# EAGLE design R451E (EAGLE 6.6.0)
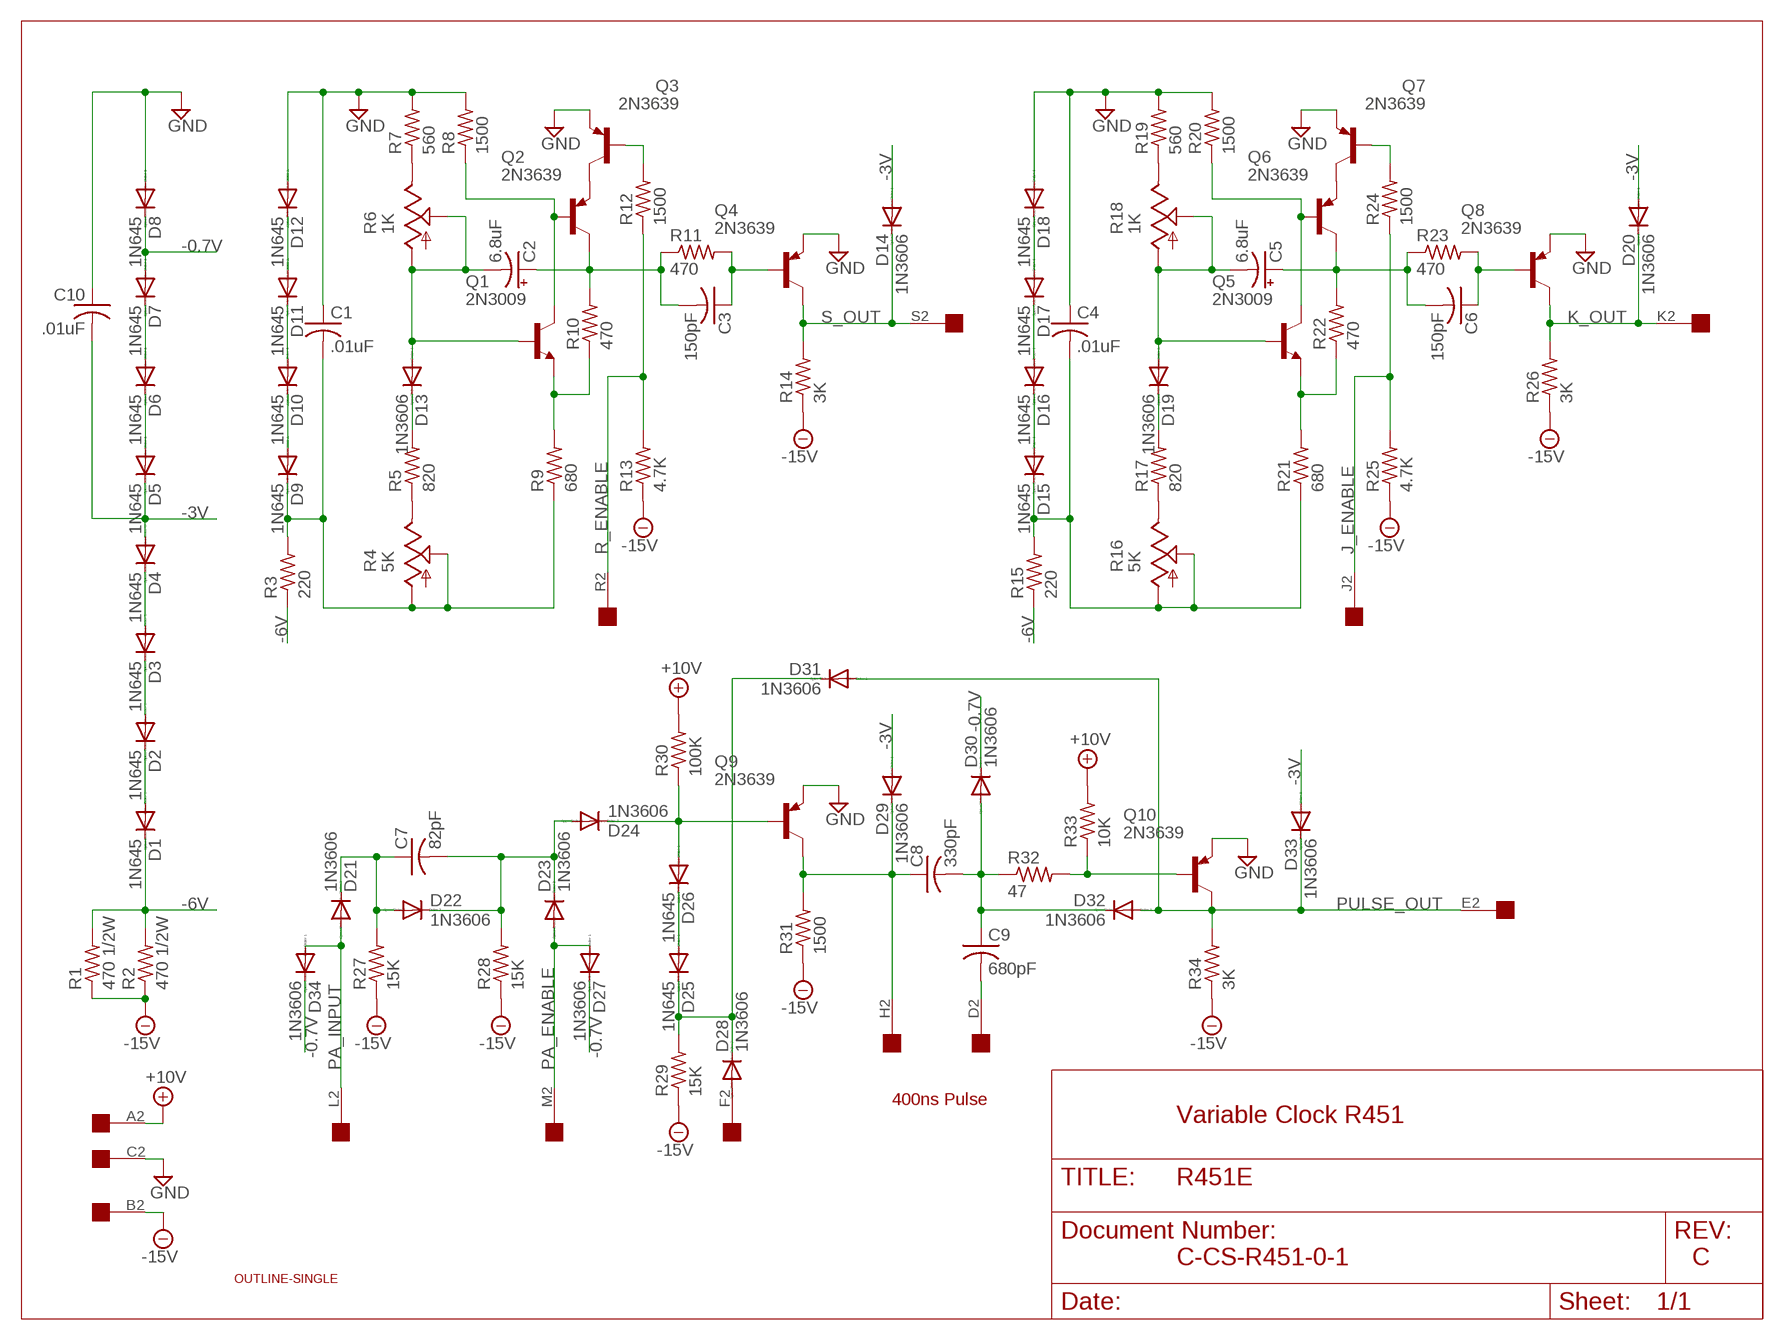
[diagram p0: schematic, sheet 1]

## Parts
C1  .01uF  C-US050-025X075  [C050-025X075]
C2  6.8uF  CPOL-USE12-4AXIAL  [E12-4]
C3  150pF  C-US075-032X103  [C075-032X103]
C4  .01uF  C-US050-025X075  [C050-025X075]
C5  6.8uF  CPOL-USE12-4AXIAL  [E12-4]
C6  150pF  C-US075-032X103  [C075-032X103]
C7  82pF  C-US075-032X103  [C075-032X103]
C8  330pF  C-US075-032X103  [C075-032X103]
C9  680pF  C-US075-032X103  [C075-032X103]
C10  .01uF  C-US050-025X075  [C050-025X075]
D1  1N645  1N4148DO35-10  [DO35-10]
D2  1N645  1N4148DO35-10  [DO35-10]
D3  1N645  1N4148DO35-10  [DO35-10]
D4  1N645  1N4148DO35-10  [DO35-10]
D5  1N645  1N4148DO35-10  [DO35-10]
D6  1N645  1N4148DO35-10  [DO35-10]
D7  1N645  1N4148DO35-10  [DO35-10]
D8  1N645  1N4148DO35-10  [DO35-10]
D9  1N645  1N4148DO35-10  [DO35-10]
D10  1N645  1N4148DO35-10  [DO35-10]
D11  1N645  1N4148DO35-10  [DO35-10]
D12  1N645  1N4148DO35-10  [DO35-10]
D13  1N3606  1N4148DO35-10  [DO35-10]
D14  1N3606  1N4148DO35-10  [DO35-10]
D15  1N645  1N4148DO35-10  [DO35-10]
D16  1N645  1N4148DO35-10  [DO35-10]
D17  1N645  1N4148DO35-10  [DO35-10]
D18  1N645  1N4148DO35-10  [DO35-10]
D19  1N3606  1N4148DO35-10  [DO35-10]
D20  1N3606  1N4148DO35-10  [DO35-10]
D21  1N3606  1N4148DO35-10  [DO35-10]
D22  1N3606  1N4148DO35-10  [DO35-10]
D23  1N3606  1N4148DO35-10  [DO35-10]
D24  1N3606  1N4148DO35-10  [DO35-10]
D25  1N645  1N4148DO35-10  [DO35-10]
D26  1N645  1N4148DO35-10  [DO35-10]
D27  1N3606  1N4148DO35-10  [DO35-10]
D28  1N3606  1N4148DO35-10  [DO35-10]
D29  1N3606  1N4148DO35-10  [DO35-10]
D30  1N3606  1N4148DO35-10  [DO35-10]
D31  1N3606  1N4148DO35-10  [DO35-10]
D32  1N3606  1N4148DO35-10  [DO35-10]
D33  1N3606  1N4148DO35-10  [DO35-10]
D34  1N3606  1N4148DO35-10  [DO35-10]
Q1  2N3009  2N2102  [TO5]
Q2  2N3639  2N2904  [TO39]
Q3  2N3639  2N2904  [TO39]
Q4  2N3639  2N2904  [TO39]
Q5  2N3009  2N2102  [TO5]
Q6  2N3639  2N2904  [TO39]
Q7  2N3639  2N2904  [TO39]
Q8  2N3639  2N2904  [TO39]
Q9  2N3639  2N2904  [TO39]
Q10  2N3639  2N2904  [TO39]
R1  470 1/2W  R-US_0411/15  [0411/15]
R2  470 1/2W  R-US_0411/15  [0411/15]
R3  220  R-US_0207/10  [0207/10]
R4  5K  TRIM_US-CT6  [CT6]
R5  820  R-US_0207/10  [0207/10]
R6  1K  TRIM_US-CT6  [CT6]
R7  560  R-US_0207/10  [0207/10]
R8  1500  R-US_0207/10  [0207/10]
R9  680  R-US_0207/10  [0207/10]
R10  470  R-US_0207/10  [0207/10]
R11  470  R-US_0207/10  [0207/10]
R12  1500  R-US_0207/10  [0207/10]
R13  4.7K  R-US_0207/10  [0207/10]
R14  3K  R-US_0207/10  [0207/10]
R15  220  R-US_0207/10  [0207/10]
R16  5K  TRIM_US-CT6  [CT6]
R17  820  R-US_0207/10  [0207/10]
R18  1K  TRIM_US-CT6  [CT6]
R19  560  R-US_0207/10  [0207/10]
R20  1500  R-US_0207/10  [0207/10]
R21  680  R-US_0207/10  [0207/10]
R22  470  R-US_0207/10  [0207/10]
R23  470  R-US_0207/10  [0207/10]
R24  1500  R-US_0207/10  [0207/10]
R25  4.7K  R-US_0207/10  [0207/10]
R26  3K  R-US_0207/10  [0207/10]
R27  15K  R-US_0207/10  [0207/10]
R28  15K  R-US_0207/10  [0207/10]
R29  15K  R-US_0207/10  [0207/10]
R30  100K  R-US_0207/10  [0207/10]
R31  1500  R-US_0207/10  [0207/10]
R32  47  R-US_0207/10  [0207/10]
R33  10K  R-US_0207/10  [0207/10]
R34  3K  R-US_0207/10  [0207/10]
U$1  OUTLINE-SINGLE  [SINGLE]
U$2  EDGE-1  [EDGE-CON1]

## Nets
+10V [Supply]: R30.2 R33.2 U$2.A2
-0.7V [Supply]: D7.A D8.C D27.C D30.C D34.C
-3V [Supply]: C10.2 D4.A D5.C D14.A D20.A D29.A D33.A
-6V [Supply]: D1.C R1.2 R2.2 R3.1 R15.1
-15V [Supply]: R1.1 R2.1 R13.1 R14.1 R25.1 R26.1 R27.1 R28.1 R29.1 R31.1 R34.1 U$2.B2
GND [Supply]: C1.1 C4.1 C10.1 D8.A D12.A D18.A Q3.1(E) Q4.1(E) Q7.1(E) Q8.1(E) Q9.1(E) Q10.1(E) R7.2 R8.2 R19.2 R20.2 U$2.C2
J_ENABLE: R24.1 R25.2 U$2.J2
K_OUT: D20.C Q8.3(C) R26.2 U$2.K2
N$1 [Supply]: D1.A D2.C
N$2 [Supply]: D5.A D6.C
N$3: D11.A D12.C
N$4: D10.A D11.C
N$5: D9.A D10.C
N$6 [Supply]: C1.2 D9.C R3.2 R4.A R4.S R9.1
N$7: Q1.1(E) R9.2 R10.1
N$8: R4.E R5.1
N$9: D13.C R5.2
N$10: C2.- D13.A Q1.2(B) R6.A R6.S
N$11: Q1.3(C) Q2.2(B) R8.1
N$12: C2.+ C3.2 Q2.3(C) R10.2 R11.1
N$13 [Supply]: D2.A D3.C
N$14 [Supply]: D3.A D4.C
N$15: Q3.2(B) R12.2
N$16: Q2.1(E) Q3.3(C)
N$17: R6.E R7.1
N$18: C3.1 Q4.2(B) R11.2
N$19: D17.A D18.C
N$20: D16.A D17.C
N$21: D15.A D16.C
N$22: C4.2 D15.C R15.2 R16.A R16.S R21.1
N$23: D19.C R17.2
N$24: D28.A U$2.F2
N$25: Q5.1(E) R21.2 R22.1
N$26: C7.1 D21.C D22.A R27.2
N$27: C5.- D19.A Q5.2(B) R18.A R18.S
N$28: C7.2 D22.C D23.C D24.A R28.2
N$29: Q5.3(C) Q6.2(B) R20.1
N$30: Q6.1(E) Q7.3(C)
N$32: R18.E R19.1
N$33: R16.E R17.1
N$34: C5.+ C6.2 Q6.3(C) R22.2 R23.1
N$35: C6.1 Q8.2(B) R23.2
N$36: Q7.2(B) R24.2
N$37: C8.1 D29.C Q9.3(C) R31.2 U$2.H2
N$39: D24.C D26.A Q9.2(B) R30.1
N$40: D25.A D26.C
N$41: D25.C D28.C D31.C R29.2
N$43: C8.2 C9.1 D30.A D32.C R32.1
N$44: C9.2 U$2.D2
N$45: Q10.2(B) R32.2 R33.1
N$47 [Supply]: D6.A D7.C
PA_ENABLE: D23.A D27.A U$2.M2
PA_INPUT: D21.A D34.A U$2.L2
PULSE_OUT: D31.A D32.A D33.C Q10.3(C) R34.2 U$2.E2
R_ENABLE: R12.1 R13.2 U$2.R2
S_OUT: D14.C Q4.3(C) R14.2 U$2.S2
Unconnected: U$2.N2 U$2.P2 U$2.T2 U$2.U2 U$2.V2

## Notes on the sheet
- 400ns Pulse
- Variable Clock R451
- C-CS-R451-0-1 | C

## Library data of the parts
C1 C3 C4 C6-C10 = rcl:C-US: CAPACITOR, American symbol
C2 C5 = dec-con:CPOL-USE12-4AXIAL: 0.5" veresion of an electrolytic
D1-D34 = diode:1N4148: DIODE high speed (Philips)
Q1 Q5 = transistor-npn:2N2102: NPN Transistor
Q2-Q4 Q6-Q10 = transistor-pnp:2N2904*: PNP Transistror
R1-R3 R5 R7-R15 R17 R19-R34 = rcl:R-US_: RESISTOR, American symbol
R4 R6 R16 R18 = pot:TRIM_US-: POTENTIOMETER
U$1 = dec-con:OUTLINE-*: Board outlines for DEC boards.
U$2 = dec-con:EDGE-1: Single-Sided DEC Edge Connector -- (side 2)

## Net classes
1 Supply: width 0.813 mm

## Board
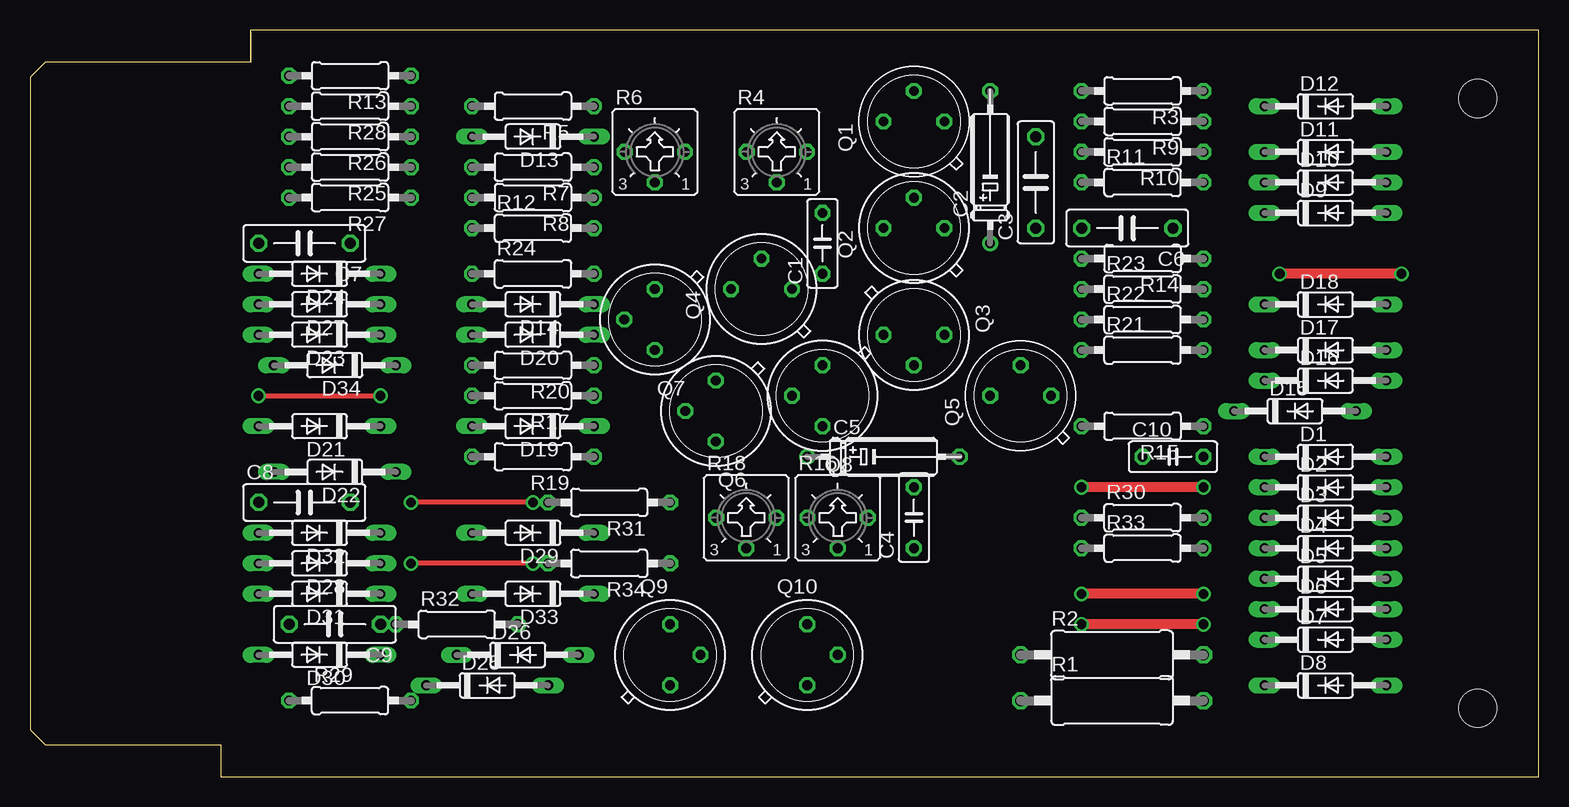
[diagram p1: board, top side]
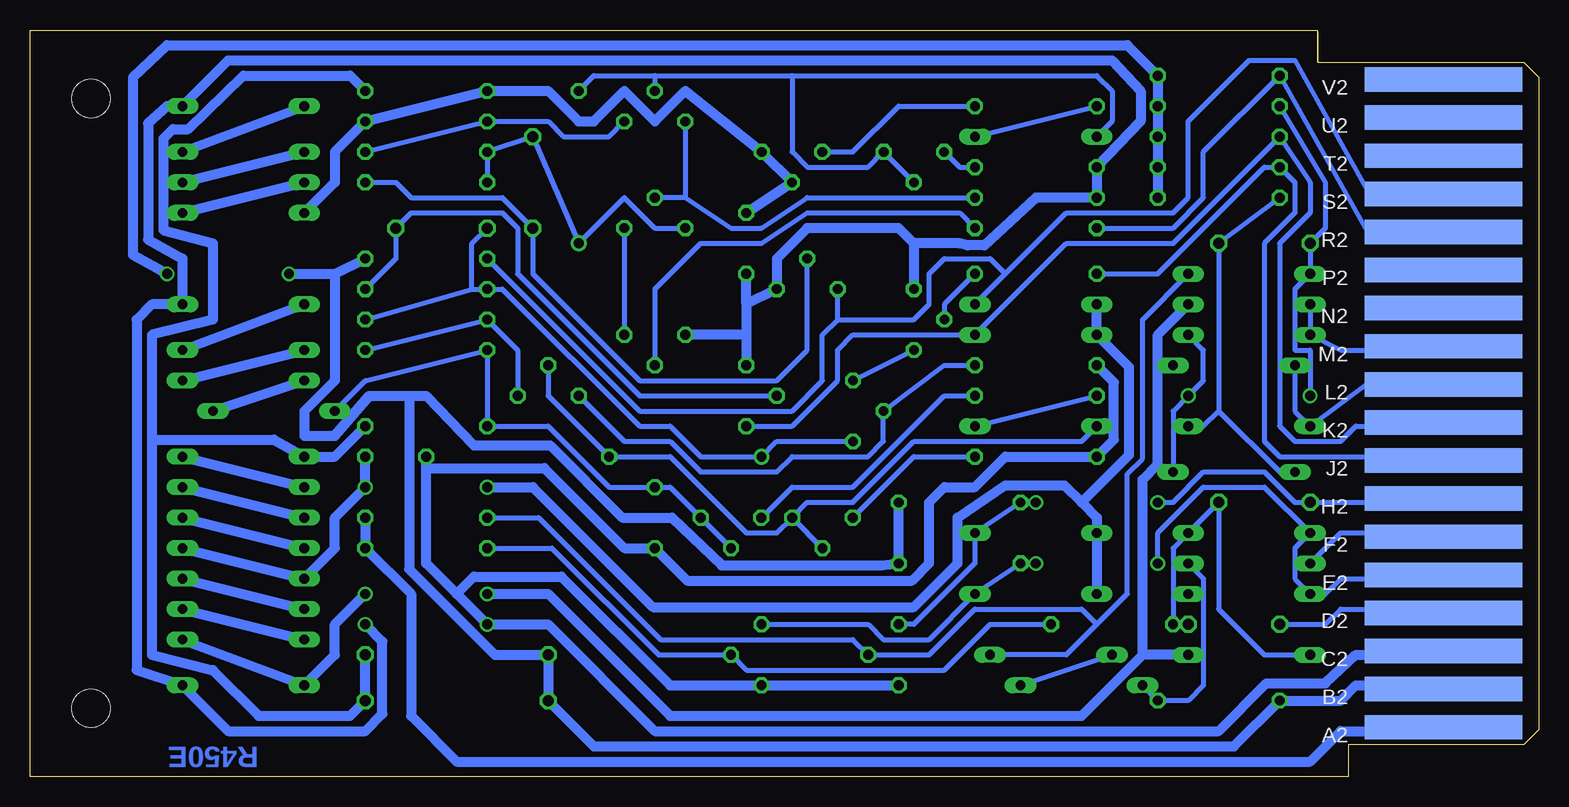
[diagram p2: board, bottom side, seen from below]

Size 125.73 x 62.23 mm. Coordinates in mm from the lower left corner, seen from the top.
Copper layers (1+16): Top 0.035mm / dielectric 1.5mm / Bottom 0.035mm
Design rules "16mils": minimum track width 16mil, minimum drill 32mil, track to track 15mil, track to pad 10mil, pad to pad 10mil, via to via 10mil, smd to smd 10mil, copper to edge 13mil, drill to drill 10mil, minimum pad ring 10mil, minimum via ring 8mil, stop-mask expansion 0mil, vias tented up to drill 0mil, thermal gap 10mil

### Footprints (pad centres in the part's own frame; a part is rotated, then mirrored left to right if it is on the bottom)
C050-025X075 = drill 0.813 octagon: 1 -2.54,0; 2 2.54,0
E12-4 = drill 0.813: + -7.62,0 | drill 0.813 octagon: - 5.08,0
C075-032X103 = drill 0.914 octagon: 1 -3.81,0; 2 3.81,0
DO35-10 = drill 0.813 long: A 5.08,0; C -5.08,0
TO5 = drill 0.813 octagon: 1 0,-2.54; 2 2.54,0; 3 0,2.54
TO39 = drill 0.813 octagon: 1 0,-2.54; 2 2.54,0; 3 0,2.54
0411/15 = drill 0.914 octagon: 1 -7.62,0; 2 7.62,0
0207/10 = drill 0.813 octagon: 1 -5.08,0; 2 5.08,0
CT6 = drill 0.813 octagon: A 2.515,0; E -2.515,0; S 0,-2.54
SINGLE = hole 3.175: 120.65,56.515; 120.65,5.715
EDGE-CON1 = smd 13.106 x 2.032 bottom: A2 7.938,4.128; B2 7.938,7.303; C2 7.938,10.477; D2 7.938,13.652; E2 7.938,16.828; F2 7.938,20.003; H2 7.938,23.177; J2 7.938,26.352; K2 7.938,29.527; L2 7.938,32.703; M2 7.938,35.877; N2 7.938,39.053; P2 7.938,42.227; R2 7.938,45.403; S2 7.938,48.578; T2 7.938,51.752; U2 7.938,54.928; V2 7.938,58.102

### Placement (x,y rotation side)
C1  66.04,44.45 90 top
C2  80.01,52.07 90 top
C3  83.82,49.53 90 top
C4  73.66,21.59 90 top
C5  72.39,26.67 0 top
C6  91.44,45.72 180 top
C7  22.86,44.45 180 top
C8  22.86,22.86 0 top
C9  25.4,12.7 180 top
C10  95.25,26.67 0 top
D1  107.95,26.67 0 top
D2  107.95,24.13 0 top
D3  107.95,21.59 0 top
D4  107.95,19.05 0 top
D5  107.95,16.51 0 top
D6  107.95,13.97 0 top
D7  107.95,11.43 0 top
D8  107.95,7.62 0 top
D9  107.95,46.99 0 top
D10  107.95,49.53 0 top
D11  107.95,52.07 0 top
D12  107.95,55.88 0 top
D13  41.91,53.34 180 top
D14  41.91,39.37 180 top
D15  105.41,30.48 0 top
D16  107.95,33.02 0 top
D17  107.95,35.56 0 top
D18  107.95,39.37 0 top
D19  41.91,29.21 180 top
D20  41.91,36.83 180 top
D21  24.13,29.21 180 top
D22  25.4,25.4 180 top
D23  24.13,36.83 180 top
D24  24.13,41.91 180 top
D25  38.1,7.62 0 top
D26  40.64,10.16 0 top
D27  24.13,39.37 180 top
D28  24.13,17.78 180 top
D29  41.91,20.32 180 top
D30  24.13,10.16 180 top
D31  24.13,15.24 180 top
D32  24.13,20.32 180 top
D33  41.91,15.24 180 top
D34  25.4,34.29 180 top
Q1  73.66,54.61 90 top
Q2  73.66,45.72 90 top
Q3  73.66,36.83 270 top
Q4  60.96,40.64 90 top
Q5  82.55,31.75 90 top
Q6  57.15,30.48 180 top
Q7  52.07,38.1 180 top
Q8  66.04,31.75 180 top
Q9  53.34,10.16 0 top
Q10  64.77,10.16 0 top
R1  90.17,6.35 0 top
R2  90.17,10.16 0 top
R3  92.71,57.15 180 top
R4  62.23,52.07 0 top
R5  41.91,55.88 180 top
R6  52.07,52.07 0 top
R7  41.91,50.8 180 top
R8  41.91,48.26 180 top
R9  92.71,54.61 180 top
R10  92.71,52.07 180 top
R11  92.71,49.53 0 top
R12  41.91,45.72 0 top
R13  26.67,58.42 180 top
R14  92.71,43.18 180 top
R15  92.71,29.21 180 top
R16  67.31,21.59 0 top
R17  41.91,31.75 180 top
R18  59.69,21.59 0 top
R19  41.91,26.67 180 top
R20  41.91,34.29 180 top
R21  92.71,35.56 0 top
R22  92.71,38.1 0 top
R23  92.71,40.64 0 top
R24  41.91,41.91 0 top
R25  26.67,50.8 180 top
R26  26.67,53.34 180 top
R27  26.67,48.26 180 top
R28  26.67,55.88 180 top
R29  26.67,6.35 0 top
R30  92.71,21.59 0 top
R31  48.26,22.86 180 top
R32  35.56,12.7 0 top
R33  92.71,19.05 0 top
R34  48.26,17.78 180 top
U$1  0,0 0 top
U$2  0,0 0 top

### Tracks (layer width: path | path; a pad name or v marks a point on that pad's centre or on a via)
+10V
  Bottom 0.813: U$2.A2 8.51,4.19 8.89,3.81 16.51,3.81 19.05,1.27 90.17,1.27 93.98,5.08 93.98,15.24 R33.2 R30.2
-0.7V  (via drill 0.81)
  Top 0.813: v97.79,15.24 v87.63,15.24
  Bottom 0.813: D7.A D8.C 100.33,10.16 100.33,12.7 v97.79,15.24 | v87.63,15.24 82.55,15.24 72.39,5.08 38.1,5.08 33.02,10.16 | D27.C 31.75,36.83 31.75,34.29 | 33.02,10.16 33.02,24.77 31.75,26.04 31.75,34.29 | D30.C 33.02,10.16 | D34.C 31.75,34.29
-3V  (via drill 0.81)
  Top 0.813: v97.79,24.13 v87.63,24.13
  Bottom 0.813: D4.A D5.C 100.33,19.05 100.33,21.59 v97.79,24.13 C10.2 | D14.A D20.A 34.13,34.13 34.13,26.83 38.1,22.86 | v87.63,24.13 83.82,24.13 73.82,14.13 52.07,14.13 48.42,17.78 48.42,21.59 | 48.42,21.59 | 48.42,21.59 44.45,24.29 39.53,24.29 38.1,22.86 | 38.1,22.86 36.83,21.59 D29.A D33.A
-6V
  Bottom 0.813: R2.2 R1.2 99.06,5.08 106.68,5.08 110.49,8.89 115.57,10.16 115.57,28.1 | 115.57,28.1 105.41,28.1 D1.C 100.33,26.67 R15.1 | R3.1 99.06,58.42 107.95,58.42 112.55,53.98 113.82,53.98 114.62,53.18 114.62,45.56 110.49,44.45 110.49,38.1 115.57,36.83 115.57,28.1
-15V  (via drill 0.81)
  Top 0.813: v114.3,41.91 v104.14,41.91
  Bottom 0.813: U$2.B2 8.6,7.33 8.89,7.62 15.24,7.62 16.51,6.35 R29.1 25.4,2.54 78.74,2.54 R1.1 R2.1 86.99,10.16 94.14,17.3 94.14,31.75 | R27.1 R25.1 R26.1 R28.1 R13.1 34.29,60.96 114.3,60.96 117.16,58.26 117.16,43.5 v114.3,41.91 | v104.14,41.91 100.33,41.91 | 100.33,41.91 R14.1 | R31.1 R34.1 54.77,17.62 68.1,17.62 72.23,21.59 76.36,21.59 82.39,27.62 86.36,27.62 88.74,27.62 92.71,31.75 94.14,31.75 | 100.33,41.91 100.33,33.02 102.87,30.48 102.87,28.42 100.33,28.42 97.47,31.75 94.14,31.75
GND  (via drill 0.81)
  Top 0.813: v97.79,12.7 v87.63,12.7
  Bottom 0.813: v97.79,12.7 96.36,11.27 96.36,5.24 97.79,3.81 109.22,3.81 D8.A 116.84,8.89 116.84,38.1 115.57,39.37 D18.A 113.03,43.18 115.89,44.77 115.89,54.45 114.3,55.88 D12.A 109.22,59.69 35.56,59.69 33.18,57.15 33.18,54.61 R7.2 R8.2 41.91,48.26 46.2,44.29 47.62,44.29 48.26,44.45 52.07,44.45 | 90.17,15.24 92.71,17.78 92.71,25.72 | 90.17,15.24 v87.63,12.7 82.55,12.7 73.66,3.81 26.67,3.81 22.7,7.78 17.78,7.78 15.24,10.16 8.89,10.16 U$2.C2 | 66.04,36.83 Q3.1 | 66.04,39.37 Q4.1 63.5,43.18 60.96,45.72 53.34,45.72 52.07,44.45 | 52.07,44.45 Q7.1 | 66.04,39.37 C1.1 | 66.04,39.37 66.04,36.83 | 66.04,36.83 Q8.1 | Q9.1 Q10.1 72.39,7.62 81.44,16.67 88.74,16.67 90.17,15.24 | 92.71,25.72 C10.1 | 92.71,25.72 82.87,25.72 76.2,19.05 C4.1 70.96,16.35 52.23,16.35 50.8,17.78 50.8,22.86 49.53,24.13 46.99,24.13 44.45,26.67 R19.2 35.4,28.1 35.4,32.86 R20.2
J_ENABLE
  Bottom 0.406: U$2.J2 8.56,26.34 8.89,26.67 21.59,26.67 22.86,27.94 22.86,44.45 20.32,46.99 20.32,49.53 R25.2 22.86,50.8 31.75,41.91 R24.1
K_OUT
  Bottom 0.406: U$2.K2 8.59,29.52 8.89,29.21 15.24,29.21 16.51,27.94 20.32,27.94 21.59,29.21 21.59,44.45 19.05,46.99 19.05,49.53 R26.2 30.48,44.45 39.37,44.45 D20.C 57.15,36.83 58.42,35.56 58.42,33.02 62.23,29.21 Q8.3
N$1
  Bottom 0.813: D1.A D2.C
N$2
  Bottom 0.813: D5.A D6.C
N$3
  Bottom 0.813: D11.A D12.C
N$4
  Bottom 0.813: D10.A D11.C
N$5
  Bottom 0.813: D9.A D10.C
N$6
  Bottom 0.813: D9.C 100.33,49.53 100.33,52.07 R9.1 R3.2 82.55,57.15 80.01,54.61 78.74,54.61 76.2,57.15 73.66,54.61 71.12,57.15 64.77,52.07 R4.A 64.74,52.04 R4.S C1.2
N$7
  Bottom 0.406: R10.1 R9.2 82.55,54.61 81.28,53.34 77.47,53.34 Q1.1
N$8
  Bottom 0.406: R4.E 57.15,52.07 53.34,55.88 R5.1
N$9
  Bottom 0.406: D13.C R5.2
N$10
  Bottom 0.406: D13.A 35.56,54.61 35.56,57.15 36.83,58.42 62.23,58.42 | 54.61,52.07 55.88,50.8 60.96,50.8 62.23,52.07 62.23,58.42 | C2.- 78.74,58.42 73.66,58.42 | 73.66,58.42 Q1.2 | 73.66,58.42 62.23,58.42 | 54.61,52.07 R6.A | 54.61,52.07 R6.S
N$11
  Bottom 0.406: R8.1 60.96,48.26 64.77,45.72 67.31,45.72 71.12,48.26 | Q1.3 71.12,48.26 | 71.12,48.26 Q2.2
N$12
  Bottom 0.406: Q2.3 73.66,45.72 76.2,48.26 C2.+ C3.2 R10.2 R11.1
N$13
  Bottom 0.813: D2.A D3.C
N$14
  Bottom 0.813: D3.A D4.C
N$15
  Bottom 0.406: R12.2 48.26,46.99 60.96,46.99 64.77,44.45 69.85,44.45 73.66,40.64 Q3.2
N$16
  Bottom 0.406: Q2.1 Q3.3
N$17
  Bottom 0.406: R6.E 49.53,52.07 48.26,50.8 R7.1
N$18
  Bottom 0.406: R11.2 95.25,49.53 93.98,48.26 86.36,48.26 C3.1 83.82,41.91 74.93,33.02 63.5,33.02 60.96,35.56 Q4.2
N$19
  Bottom 0.813: D17.A D18.C
N$20
  Bottom 0.813: D16.A D17.C
N$21
  Bottom 0.813: D15.A D16.C
N$22
  Bottom 0.406: D15.C 97.79,33.02 R21.1 R15.2 82.55,29.21 77.47,24.13 C4.2 72.39,24.13 69.85,21.59 | 69.85,21.59 R16.A | 69.85,21.59 R16.S
N$23
  Bottom 0.406: D19.C R17.2
N$24
  Bottom 0.406: U$2.F2 7.92,20.32 16.51,20.32 D28.A
N$25
  Bottom 0.406: R21.2 R22.1 85.09,35.56 Q5.1
N$26
  Bottom 0.406: 26.67,30.48 27.94,29.21 D21.C | 26.67,30.48 C7.1 R27.2 | D22.A 21.59,25.4 26.67,30.48
N$27
  Bottom 0.406: Q5.2 82.55,31.75 C5.- 72.39,26.67 66.04,20.32 63.5,20.32 62.23,21.59 | 62.23,21.59 R18.S | D19.A 38.1,27.94 52.07,27.94 57.15,22.86 60.96,22.86 62.23,21.59 | 62.23,21.59 R18.A
N$28  (via drill 0.81)
  Top 0.406: v19.05,31.75 v29.21,31.75
  Bottom 0.406: D23.C 27.94,35.56 27.94,33.02 v29.21,31.75 30.48,30.48 D22.C | v19.05,31.75 19.05,35.56 20.32,35.56 20.32,40.64 D24.A C7.2 17.78,45.72 17.78,49.53 R28.2
N$29
  Bottom 0.406: Q5.3 76.2,27.94 72.39,27.94 69.85,25.4 63.5,25.4 62.23,26.67 55.88,26.67 54.61,27.94 Q6.2 49.53,34.29 R20.1
N$30
  Bottom 0.406: Q6.1 Q7.3
N$32
  Bottom 0.406: R18.E 57.15,21.59 52.07,26.67 R19.1
N$33
  Bottom 0.406: R16.E 64.77,21.59 62.23,24.13 57.15,24.13 49.53,31.75 R17.1
N$34
  Bottom 0.406: Q6.3 63.5,27.94 C5.+ 69.85,26.67 72.39,29.21 74.93,29.21 86.36,40.64 R23.1 88.9,40.64 | C6.2 88.9,44.45 88.9,40.64 | R22.2 88.9,40.64
N$35
  Bottom 0.406: R23.2 95.25,43.18 C6.1 93.98,46.99 86.36,46.99 85.09,45.72 85.09,41.91 74.93,31.75 Q8.2
N$36
  Bottom 0.406: Q7.2 49.53,39.37 R24.2
N$37  (via drill 0.81)
  Top 0.406: v41.91,22.86 v31.75,22.86
  Bottom 0.406: U$2.H2 7.97,22.86 C8.1 20.32,22.86 22.86,25.4 27.94,25.4 30.48,22.86 v31.75,22.86 | Q9.3 52.07,12.7 46.99,17.78 D29.C R31.2 v41.91,22.86
N$39
  Bottom 0.406: D24.C 33.02,38.1 33.02,26.51 34.29,25.24 34.29,15.24 36.83,12.7 | 36.83,12.7 39.37,10.16 D26.A | R30.1 83.34,21.59 73.18,11.43 57.15,11.43 Q9.2 50.8,10.16 46.99,13.97 38.1,13.97 36.83,12.7
N$40
  Bottom 0.406: D25.A D26.C
N$41
  Bottom 0.406: 27.94,15.24 27.94,7.62 29.21,6.35 R29.2 D25.C | 27.94,15.24 27.94,16.51 D28.C | 27.94,15.24 D31.C
N$43
  Bottom 0.406: D30.A 22.86,10.16 26.67,13.97 C8.2 D32.C 30.48,19.05 R32.1 C9.1
N$44
  Bottom 0.406: U$2.D2 8,13.97 16.51,13.97 17.78,12.7 C9.2
N$45
  Bottom 0.406: R33.1 82.23,19.05 73.34,10.16 Q10.2 66.04,8.89 49.53,8.89 45.72,12.7 R32.2
N$47
  Bottom 0.813: D6.A D7.C
PA_ENABLE
  Bottom 0.406: U$2.M2 8.89,35.56 16.51,35.56 D23.A D27.A
PA_INPUT
  Bottom 0.406: U$2.L2 8.56,32.69 8.89,33.02 13.97,33.02 D21.A 20.32,30.48 D34.A
PULSE_OUT  (via drill 0.81)
  Top 0.406: v41.91,17.78 v31.75,17.78
  Bottom 0.406: U$2.E2 8.02,16.51 16.51,16.51 17.78,15.24 D31.A 20.32,16.51 20.32,19.05 D32.A 22.86,24.13 27.94,24.13 31.75,20.32 v31.75,17.78 | Q10.3 55.88,12.7 54.61,11.43 50.8,11.43 D33.C R34.2 v41.91,17.78
R_ENABLE
  Bottom 0.406: U$2.R2 9.83,45.39 10.16,45.72 14.45,45.72 R13.2 27.94,52.07 27.94,48.26 30.48,45.72 R12.1
S_OUT
  Bottom 0.406: U$2.S2 8,48.26 13.97,48.26 20.32,59.69 24.13,59.69 29.21,54.61 29.21,48.26 30.48,46.99 39.37,46.99 44.45,41.91 | 44.45,41.91 D14.C | 58.42,38.1 Q4.3 | 58.42,38.1 52.07,38.1 50.8,39.37 50.8,41.91 49.53,43.18 45.72,43.18 44.45,41.91 | R14.2 74.93,30.48 62.23,30.48 59.69,33.02 59.69,36.83 58.42,38.1

### Text on the board
Bottom: R450E
Document: Use R450E etch.
200bmp: C:/Users/Vince/Documents/eagle/projects/DEC/Rxxx/R451/R451Ebackfb.bmp